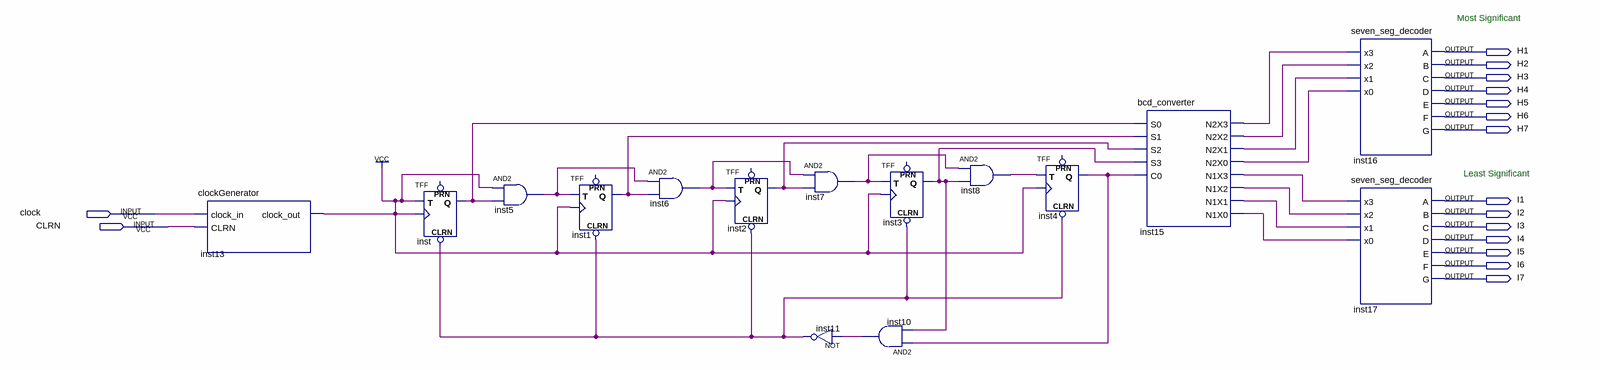
[diagram p0: schematic sheet]
// Quartus schematic counter_24.bdf as structural Verilog: 15 symbols, 16 pins
module counter_24 (
  input  clock,
  input  CLRN,
  output H1,
  output H2,
  output H3,
  output H4,
  output H5,
  output H6,
  output H7,
  output I1,
  output I2,
  output I3,
  output I4,
  output I5,
  output I6,
  output I7
);

  wire inst1_q, inst2_q, inst3_q, inst4_q, inst5_out, inst6_out, inst7_out, inst8_out, inst10_out,
       inst11_out, inst13_clock_out, inst15_n1x0, inst15_n1x1, inst15_n1x2, inst15_n1x3, inst15_n2x0,
       inst15_n2x1, inst15_n2x2, inst15_n2x3, inst_q;

  clockGenerator inst13 (.clock_in(clock), .CLRN(CLRN), .clock_out(inst13_clock_out));
  TFF inst (.CLRN(inst11_out), .T(inst13_clock_out), .CLK(inst13_clock_out), .Q(inst_q));  // open: PRN
  and inst5 (inst5_out, inst13_clock_out, inst_q);
  TFF inst1 (.CLRN(inst11_out), .T(inst5_out), .CLK(inst13_clock_out), .Q(inst1_q));  // open: PRN
  and inst6 (inst6_out, inst5_out, inst1_q);
  TFF inst2 (.CLRN(inst11_out), .T(inst6_out), .CLK(inst13_clock_out), .Q(inst2_q));  // open: PRN
  and inst7 (inst7_out, inst6_out, inst2_q);
  not inst11 (inst11_out, inst10_out);
  and inst10 (inst10_out, inst4_q, inst3_q);
  TFF inst3 (.CLRN(inst11_out), .T(inst7_out), .CLK(inst13_clock_out), .Q(inst3_q));  // open: PRN
  and inst8 (inst8_out, inst7_out, inst3_q);
  TFF inst4 (.CLRN(inst11_out), .T(inst8_out), .CLK(inst13_clock_out), .Q(inst4_q));  // open: PRN
  bcd_converter inst15 (
    .S0(inst_q), .S1(inst1_q), .S2(inst2_q), .S3(inst3_q), .C0(inst4_q), .N2X3(inst15_n2x3),
    .N2X2(inst15_n2x2), .N2X1(inst15_n2x1), .N2X0(inst15_n2x0), .N1X3(inst15_n1x3), .N1X2(inst15_n1x2),
    .N1X1(inst15_n1x1), .N1X0(inst15_n1x0));
  seven_seg_decoder inst16 (
    .x3(inst15_n2x3), .x2(inst15_n2x2), .x1(inst15_n2x1), .x0(inst15_n2x0), .A(H1), .B(H2), .C(H3), .D(H4),
    .E(H5), .F(H6), .G(H7));
  seven_seg_decoder inst17 (
    .x3(inst15_n1x3), .x2(inst15_n1x2), .x1(inst15_n1x1), .x0(inst15_n1x0), .A(I1), .B(I2), .C(I3), .D(I4),
    .E(I5), .F(I6), .G(I7));
  // also tied to VCC on the sheet: inst13_clock_out

  // Notes on the sheet:
  //   Most Significant
  //   Least Significant
endmodule
